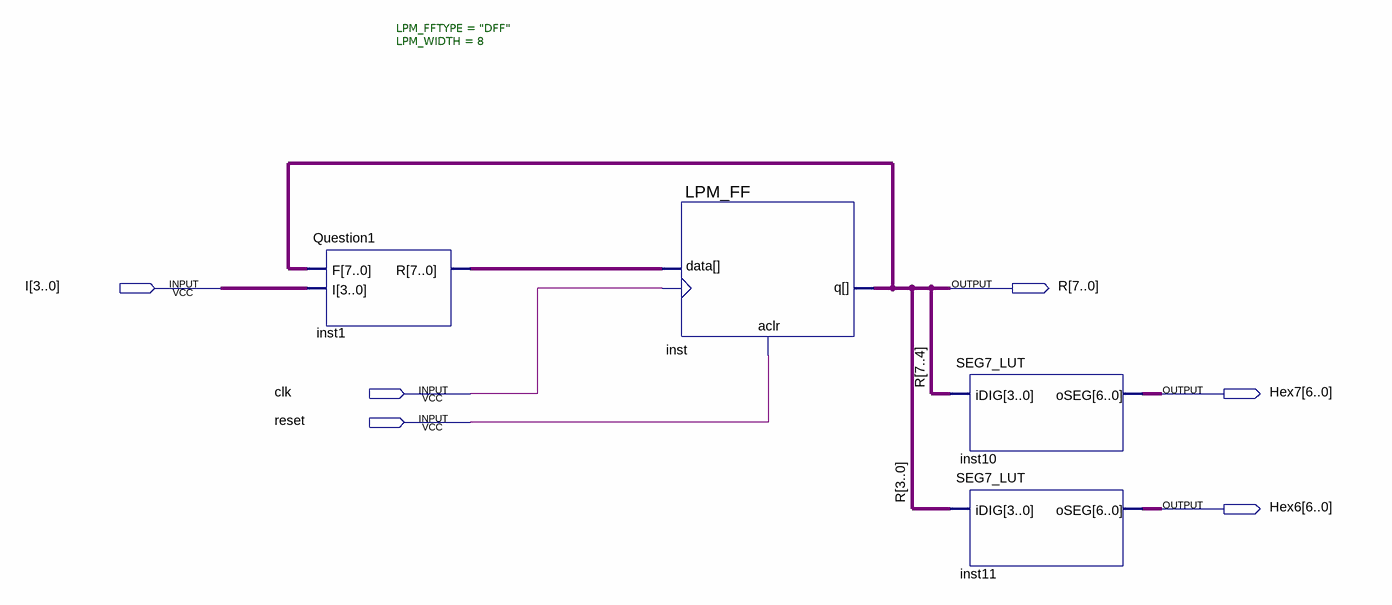
[diagram p0: schematic sheet]
// Quartus schematic accumulator.bdf as structural Verilog: 4 symbols, 6 pins
module accumulator (
  input  [3:0] I,
  input  clk,
  input  reset,
  output [7:0] R,
  output [6:0] Hex7,
  output [6:0] Hex6
);

  wire [7:0] inst1_r;

  Question1 inst1 (.F(R), .I(I), .R(inst1_r));
  LPM_FF #(.LPM_FFTYPE("DFF"), .LPM_WIDTH(8)) inst (.clock(clk), .aclr(reset), .data(inst1_r), .q(R));
  SEG7_LUT inst10 (.iDIG(R[7:4]), .oSEG(Hex7));
  SEG7_LUT inst11 (.iDIG(R[3:0]), .oSEG(Hex6));
endmodule
